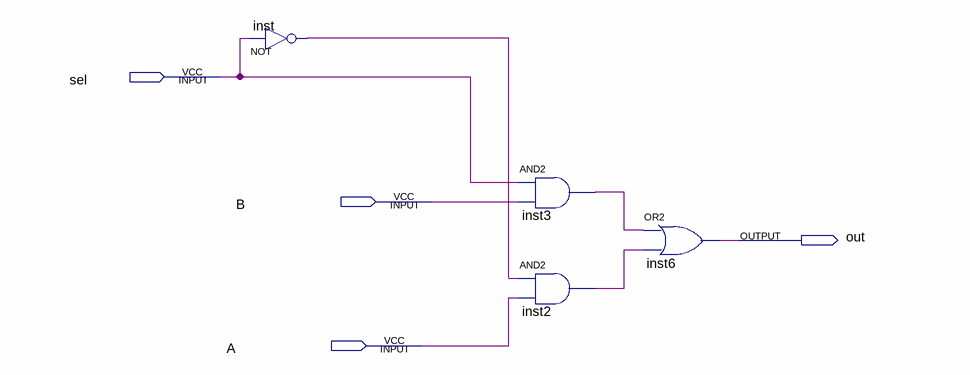
[diagram p0: schematic sheet]
// Quartus schematic MUX2x1.bdf as structural Verilog: 4 symbols, 4 pins
module MUX2x1 (
  input  sel,
  input  B,
  input  A,
  output out
);

  wire inst2_out, inst3_out, inst_out;

  not inst (inst_out, sel);
  and inst3 (inst3_out, sel, B);
  and inst2 (inst2_out, inst_out, A);
  or inst6 (out, inst3_out, inst2_out);
endmodule
